# Altium schematic sheet RS_iface.SchDoc
size A4
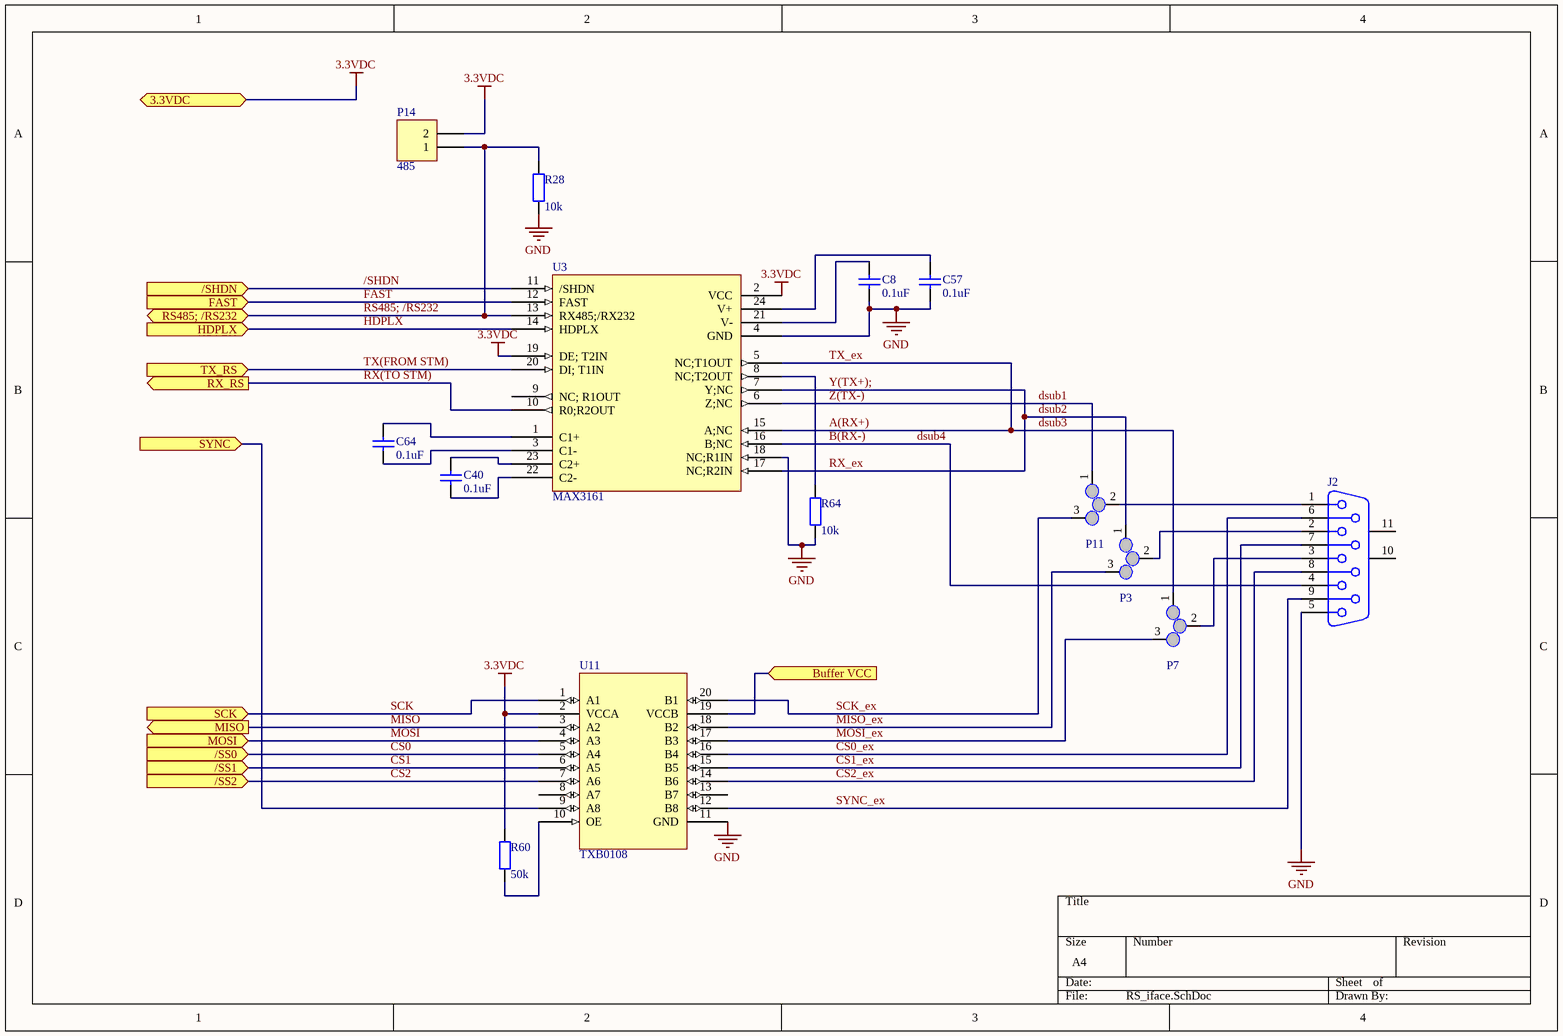
[diagram p0: RS_iface.SchDoc]

## Parts
C8  value 0.1uF  [C_0603]  (hidden comment: Cap)
C40  value 0.1uF  [C_0603]  (hidden comment: Cap)
C57  value 0.1uF  [C_0603]  (hidden comment: Cap)
C64  value 0.1uF  [C_0603]  (hidden comment: Cap)
J2  DSUB Male  [DSUB1.385-2H9M]  (value not drawn)
P3  SWI_CONN  [SW_SPDT]  (value not drawn)  (net tie, no BOM)
P7  SWI_CONN  [SW_SPDT]  (value not drawn)  (net tie, no BOM)
P11  SWI_CONN  [SW_SPDT]  (value not drawn)  (net tie, no BOM)
P14  485  [HDR1X2]
R28  value 10k  [R_0603]  (hidden comment: Res)
R60  value 50k  [R_0603]  (hidden comment: Res)
R64  value 10k  [R_0603]  (hidden comment: Res)
U3  MAX3161  [DB024]
U11  TXB0108  [TSOP65P640X120-20N]

## Ports
3.3VDC, /SHDN (in), /SS0 (in), /SS1 (in), /SS2 (in), Buffer VCC (in), FAST (in), HDPLX (in), MISO (out), MOSI (in), RS485; /RS232, RX_RS (out), SCK (in), SYNC (in), TX_RS (in)

## Nets
3.3VDC: P14.2 R60.2 U3.2(VCC) U3.19(DE;_T2IN) U11.2(VCCA) ; port 3.3VDC
GND: C8.2 C57.2 J2.5 R28.1 R64.1 U3.4(GND) U3.18(NC;R1IN) U11.11(GND)
/SHDN: U3.11(/SHDN) ; port /SHDN
A(RX+): P7.1 U3.5(NC;T1OUT) U3.15(A;NC)  [also labelled dsub3, TX_ex]
B(RX-): J2.4 U3.16(B;NC)  [also labelled dsub4]
Buffer VCC: U11.19(VCCB) ; port Buffer VCC
CS0: U11.5(A4) ; port /SS0
CS0_ex: J2.6 U11.16(B4)
CS1: U11.6(A5) ; port /SS1
CS1_ex: J2.7 U11.15(B5)
CS2: U11.7(A6) ; port /SS2
CS2_ex: J2.8 U11.14(B6)
dsub1: P11.1 U3.6(Z;NC)  [also labelled Z(TX-)]
dsub2: P3.1 U3.7(Y;NC) U3.17(NC;R2IN)  [also labelled RX_ex, Y(TX+);]
FAST: U3.12(FAST) ; port FAST
HDPLX: U3.14(HDPLX) ; port HDPLX
MISO: U11.3(A2) ; port MISO
MISO_ex: P3.3 U11.18(B2)
MOSI: U11.4(A3) ; port MOSI
MOSI_ex: P7.3 U11.17(B3)
RS485; /RS232: P14.1 R28.2 U3.13(RX485;/RX232) ; port RS485; /RS232
RX(TO STM): U3.10(R0;R2OUT) ; port RX_RS
SCK: U11.1(A1) ; port SCK
SCK_ex: P11.3 U11.20(B1)
SYNC: U11.9(A8) ; port SYNC
SYNC_ex: J2.9 U11.12(B8)
TX(FROM STM): U3.20(DI;_T1IN) ; port TX_RS
NetC8_1: C8.1 U3.21(V-)
NetC40_1: C40.1 U3.23(C2+)
NetC40_2: C40.2 U3.22(C2-)
NetC57_1: C57.1 U3.24(V+)
NetC64_1: C64.1 U3.1(C1+)
NetC64_2: C64.2 U3.3(C1-)
NetJ2_1: J2.1 P11.2
NetJ2_2: J2.2 P3.2
NetJ2_3: J2.3 P7.2
NetR60_1: R60.1 U11.10(OE)
NetR64_2: R64.2 U3.8(NC;T2OUT)

Not connected (* = marked no-connect by the designer): J2 10(MH1) 11(MH2); U3 9(NC;_R1OUT); U11 8(A7) 13(B7)

## Library data of the parts
C8 C40 C57 C64 = C0603: Capacitor; Note: Footprint corresponds to dimensions for bulk cassette packaging. This case size has tightened tolerances.; Published: 17-Jul-2002; LatestRevisionDate: 19-Mar-2004; LatestRevisionNote: Silkscreen size reduced.; PackageReference: 0603; Publisher: Altium Limited; DatasheetDocument: Mar-2001; PackageDocument: Mar-2001; Code_JEITA: 0603; Code_IPC: 1608 [0603]; ComponentLink1Description: Manufacturer Link; ComponentLink1URL: http://www.kemet.com/; ComponentLink2Description: Datasheet; ComponentLink2URL: http://www.kemet.com/kemet/web/homepage/kechome.nsf/vapubfilesname/F3102TA.pdf/$file/F3102TA.pdf
J2 = D Connector 9: DSUB9 Male connector; PackageDocument: O; Positions: 9; Gender: Receptacle; Published: 15-Jun-2001; LatestRevisionDate: 17-Jul-2002; LatestRevisionNote: Re-released for DXP Platform.; DatasheetDocument: 1-Sep-1999; PackageReference: 788750; Publisher: Altium Limited; Orientation: Right Angle
P3 P7 P11 = SWI_CONN: Soldering switch
P14 = Header 2H: Header, 2-Pin, 2.54mm pitch; LatestRevisionDate: 17-Jul-2002; LatestRevisionNote: Re-released for DXP Platform.; Publisher: Altium Limited
R28 R60 R64 = Res2: Resistor; Published: 8-Jun-2000; LatestRevisionDate: 17-Jul-2002; LatestRevisionNote: Re-released for DXP Platform.; PackageReference: AXIAL-0.4; Publisher: Altium Limited; PackageDescription: Axial Device, Thru-Hole; 2 Leads; 0.4 in Pin Spacing
U3 = MAX3161: Multitrancivier
U11 = TXB0108: SPI buffer